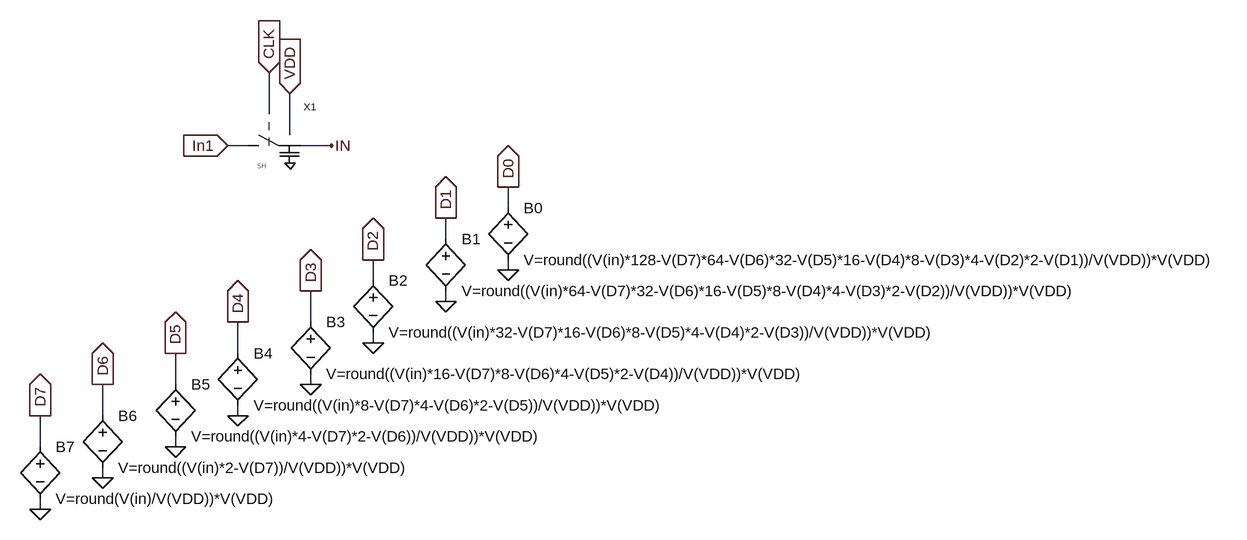
[diagram p0: schematic 4Bit_ADC_pipeV2.asc]
4Bit_ADC_pipeV2.asc, the LTspice schematic file:
Version 4
SHEET 1 1812 680
WIRE 48 -272 48 -336
WIRE 80 -240 80 -304
WIRE 16 -224 -16 -224
WIRE 144 -224 96 -224
WIRE 416 -128 416 -160
WIRE 320 -80 320 -112
WIRE 416 -32 416 -48
WIRE 208 -16 208 -48
WIRE 320 16 320 0
WIRE 112 48 112 0
WIRE 208 80 208 64
WIRE 0 96 0 48
WIRE -96 144 -96 96
WIRE 112 144 112 128
WIRE -208 192 -208 144
WIRE 0 192 0 176
WIRE -304 240 -304 192
WIRE -96 240 -96 224
WIRE -208 288 -208 272
WIRE -304 336 -304 320
FLAG 144 -224 IN
FLAG 112 144 0
FLAG 112 0 D3
IOPIN 112 0 Out
FLAG 208 80 0
FLAG 208 -48 D2
IOPIN 208 -48 Out
FLAG 320 16 0
FLAG 320 -112 D1
IOPIN 320 -112 Out
FLAG 416 -32 0
FLAG 416 -160 D0
IOPIN 416 -160 Out
FLAG -16 -224 In1
IOPIN -16 -224 In
FLAG 48 -336 CLK
IOPIN 48 -336 In
FLAG 80 -304 VDD
IOPIN 80 -304 In
FLAG 0 192 0
FLAG 0 48 D4
IOPIN 0 48 Out
FLAG -96 240 0
FLAG -96 96 D5
IOPIN -96 96 Out
FLAG -208 288 0
FLAG -208 144 D6
IOPIN -208 144 Out
FLAG -304 336 0
FLAG -304 192 D7
IOPIN -304 192 Out
SYMBOL bv 112 32 R0
SYMATTR InstName B3
SYMATTR Value V=round((V(in)*16-V(D7)*8-V(D6)*4-V(D5)*2-V(D4))/V(VDD))*V(VDD)
SYMBOL bv 208 -32 R0
SYMATTR InstName B2
SYMATTR Value V=round((V(in)*32-V(D7)*16-V(D6)*8-V(D5)*4-V(D4)*2-V(D3))/V(VDD))*V(VDD)
SYMBOL bv 320 -96 R0
SYMATTR InstName B1
SYMATTR Value V=round((V(in)*64-V(D7)*32-V(D6)*16-V(D5)*8-V(D4)*4-V(D3)*2-V(D2))/V(VDD))*V(VDD)
SYMBOL bv 416 -144 R0
SYMATTR InstName B0
SYMATTR Value V=round((V(in)*128-V(D7)*64-V(D6)*32-V(D5)*16-V(D4)*8-V(D3)*4-V(D2)*2-V(D1))/V(VDD))*V(VDD)
SYMBOL sample_hold 16 -208 R0
SYMATTR InstName X1
SYMBOL bv 0 80 R0
SYMATTR InstName B4
SYMATTR Value V=round((V(in)*8-V(D7)*4-V(D6)*2-V(D5))/V(VDD))*V(VDD)
SYMBOL bv -96 128 R0
SYMATTR InstName B5
SYMATTR Value V=round((V(in)*4-V(D7)*2-V(D6))/V(VDD))*V(VDD)
SYMBOL bv -208 176 R0
SYMATTR InstName B6
SYMATTR Value V=round((V(in)*2-V(D7))/V(VDD))*V(VDD)
SYMBOL bv -304 224 R0
SYMATTR InstName B7
SYMATTR Value V=round(V(in)/V(VDD))*V(VDD)

The netlist it stands for:
* 4Bit_ADC_pipeV2.asc
B3 D3 0 V=round((V(in)*16-V(D7)*8-V(D6)*4-V(D5)*2-V(D4))/V(VDD))*V(VDD)
B2 D2 0 V=round((V(in)*32-V(D7)*16-V(D6)*8-V(D5)*4-V(D4)*2-V(D3))/V(VDD))*V(VDD)
B1 D1 0 V=round((V(in)*64-V(D7)*32-V(D6)*16-V(D5)*8-V(D4)*4-V(D3)*2-V(D2))/V(VDD))*V(VDD)
B0 D0 0 V=round((V(in)*128-V(D7)*64-V(D6)*32-V(D5)*16-V(D4)*8-V(D3)*4-V(D2)*2-V(D1))/V(VDD))*V(VDD)
XX1 In1 IN CLK VDD sample_hold  ; pins P1 P2 clk VDD
B4 D4 0 V=round((V(in)*8-V(D7)*4-V(D6)*2-V(D5))/V(VDD))*V(VDD)
B5 D5 0 V=round((V(in)*4-V(D7)*2-V(D6))/V(VDD))*V(VDD)
B6 D6 0 V=round((V(in)*2-V(D7))/V(VDD))*V(VDD)
B7 D7 0 V=round(V(in)/V(VDD))*V(VDD)
.backanno
.end